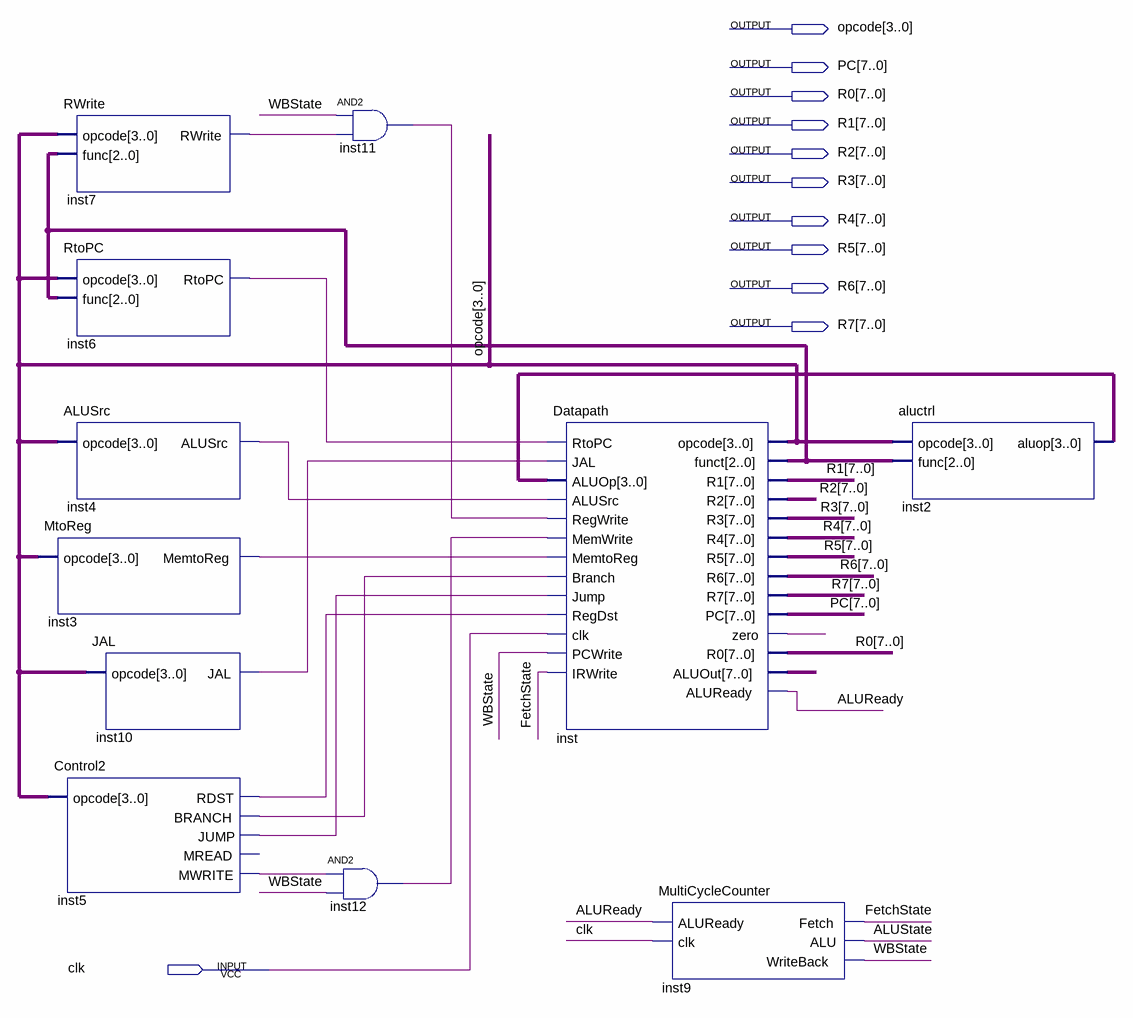
[diagram p0: schematic sheet]
// Quartus schematic CPU.bdf as structural Verilog: 11 symbols, 11 pins
module CPU (
  input  clk,
  output [3:0] opcode,
  output [7:0] PC,
  output [7:0] R0,
  output [7:0] R1,
  output [7:0] R2,
  output [7:0] R3,
  output [7:0] R4,
  output [7:0] R5,
  output [7:0] R6,
  output [7:0] R7
);

  wire ALUReady, ALUState, FetchState, inst3_memtoreg, inst4_alusrc, inst5_branch, inst5_jump, inst5_mwrite,
       inst5_rdst, inst6_rtopc, inst7_rwrite, inst10_jal, inst11_out, inst12_out, inst_zero, WBState;
  wire [2:0] inst_funct;
  wire [3:0] inst2_aluop;
  wire [7:0] inst_aluout;

  RWrite inst7 (.opcode(opcode), .func(inst_funct), .RWrite(inst7_rwrite));
  RtoPC inst6 (.opcode(opcode), .func(inst_funct), .RtoPC(inst6_rtopc));
  ALUSrc inst4 (.opcode(opcode), .ALUSrc(inst4_alusrc));
  MtoReg inst3 (.opcode(opcode), .MemtoReg(inst3_memtoreg));
  JAL inst10 (.opcode(opcode), .JAL(inst10_jal));
  Control2 inst5 (
    .opcode(opcode), .RDST(inst5_rdst), .BRANCH(inst5_branch), .JUMP(inst5_jump), .MWRITE(inst5_mwrite));  // open: MREAD
  and inst12 (inst12_out, inst5_mwrite, WBState);
  and inst11 (inst11_out, WBState, inst7_rwrite);
  Datapath inst (
    .RtoPC(inst6_rtopc), .JAL(inst10_jal), .ALUOp(inst2_aluop), .ALUSrc(inst4_alusrc), .RegWrite(inst11_out),
    .MemWrite(inst12_out), .MemtoReg(inst3_memtoreg), .Branch(inst5_branch), .Jump(inst5_jump),
    .RegDst(inst5_rdst), .clk(clk), .PCWrite(WBState), .IRWrite(FetchState), .opcode(opcode),
    .funct(inst_funct), .R1(R1), .R2(R2), .R3(R3), .R4(R4), .R5(R5), .R6(R6), .R7(R7), .PC(PC),
    .zero(inst_zero), .R0(R0), .ALUOut(inst_aluout), .ALUReady(ALUReady));
  MultiCycleCounter inst9 (.ALUReady(ALUReady), .clk(clk), .Fetch(FetchState), .ALU(ALUState), .WriteBack(WBState));
  aluctrl inst2 (.opcode(opcode), .func(inst_funct), .aluop(inst2_aluop));
endmodule
